# EAGLE design RPIBoard (EAGLE 7.6.0)
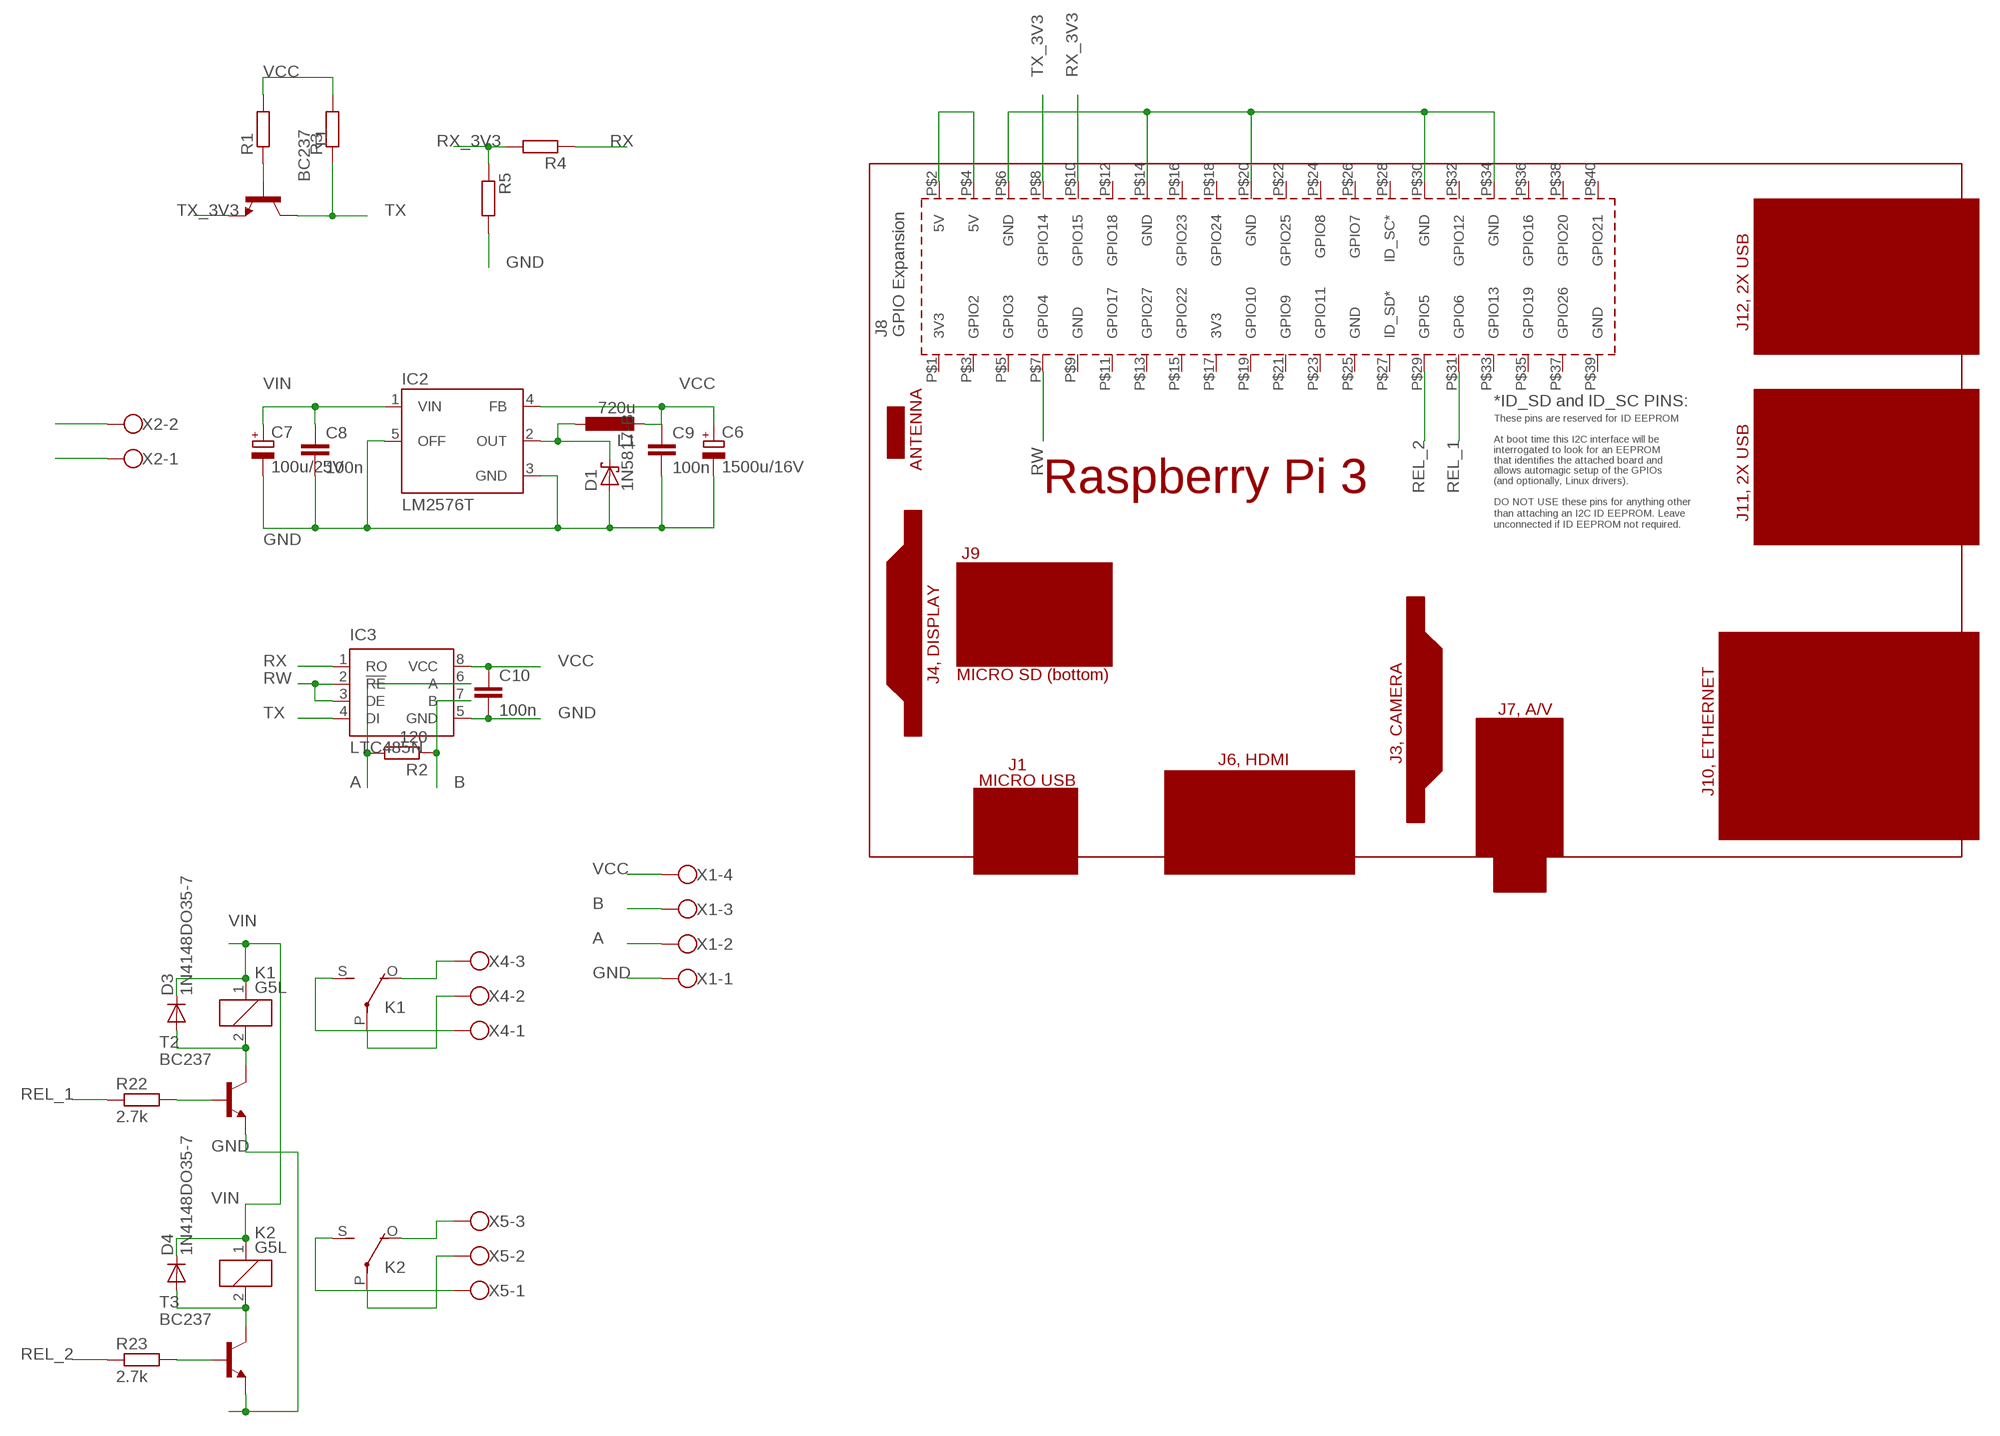
[diagram p0: schematic, sheet 1]

## Parts
C6  1500u/16V  CPOL-EUE5-10.5  [E5-10,5]
C7  100u/25V  CPOL-EUE2.5-7  [E2,5-7]
C8  100n  C-EU025-024X044  [C025-024X044]
C9  100n  C-EU025-024X044  [C025-024X044]
C10  100n  C-EU025-024X044  [C025-024X044]
D1  1N5817-B  [DO41-7.6]
D3  1N4148DO35-7  [DO35-7]
D4  1N4148DO35-7  [DO35-7]
IC2  LM2576T  [TO220-5]
IC3  LTC485N  [DIL08]
K1  G5L  [G5LE]
K2  G5L  [G5LE]
L1  720u  L-EUTJ3-U1  [TJ3-U1]
PCB1  RPI3  [RPI3]
R1  R-EU_0207/7  [0207/7]
R2  120  R-EU_0204/7  [0204/7]
R3  R-EU_0207/7  [0207/7]
R4  R-EU_0207/7  [0207/7]
R5  R-EU_0207/7  [0207/7]
R22  2.7k  R-EU_0204/7  [0204/7]
R23  2.7k  R-EU_0204/7  [0204/7]
T1  BC237  [TO92]
T2  BC237  [TO92]
T3  BC237  [TO92]
X1  W237-4  [W237-4]
X2  W237-102  [W237-102]
X4  W237-103  [W237-103]
X5  W237-103  [W237-103]

## Nets
A: IC3.6(A) R2.2 X1.2
B: IC3.7(B) R2.1 X1.3
GND: C6.- C7.- C8.2 C9.2 C10.2 D1.A IC2.3(GND) IC2.5(OFF) IC3.5(GND) PCB1.P$6(GND) PCB1.P$14(GND) PCB1.P$20(GND) PCB1.P$30(GND) PCB1.P$34(GND) R5.2 T2.1(E) T3.1(E) X1.1 X2.1
N$1: R1.1 T1.2(B)
N$2: D1.C IC2.2(OUT) L1.1
N$3: K2.O(2:O) X5.3
N$4: K2.S(2:S) X5.1
N$5: K1.S(2:S) X4.1
N$6: K1.O(2:O) X4.3
N$8: D3.A K1.2 T2.3(C)
N$13: R22.2 T2.2(B)
N$16: K1.P(2:P) X4.2
N$18: D4.A K2.2 T3.3(C)
N$19: R23.2 T3.2(B)
N$22: K2.P(2:P) X5.2
REL_1: PCB1.P$31(GPIO6) R22.1
REL_2: PCB1.P$29(GPIO5) R23.1
RW: IC3.2(!RE) IC3.3(DE) PCB1.P$7(GPIO4)
RX: IC3.1(RO) R4.1
RX_3V3: PCB1.P$10(GPIO15) R4.2 R5.1
TX: IC3.4(DI) R3.1 T1.3(C)
TX_3V3: PCB1.P$8(GPIO14) T1.1(E)
VCC: C6.+ C9.1 C10.1 IC2.4(FB) IC3.8(VCC) L1.2 PCB1.P$2(5V) PCB1.P$4(5V) R1.2 R3.2 X1.4
VIN: C7.+ C8.1 D3.C D4.C IC2.1(VIN) K1.1 K2.1 X2.2
Unconnected: PCB1.P$1(3V3) PCB1.P$3(GPIO2) PCB1.P$5(GPIO3) PCB1.P$9(GND) PCB1.P$11(GPIO17) PCB1.P$12(GPIO18) PCB1.P$13(GPIO27) PCB1.P$15(GPIO22) PCB1.P$16(GPIO23) PCB1.P$17(3V3) PCB1.P$18(GPIO24) PCB1.P$19(GPIO10) PCB1.P$21(GPIO9) PCB1.P$22(GPIO25) PCB1.P$23(GPIO11) PCB1.P$24(GPIO8) PCB1.P$25(GND) PCB1.P$26(GPIO7) PCB1.P$27(ID_SD*) PCB1.P$28(ID_SC*) PCB1.P$32(GPIO12) PCB1.P$33(GPIO13) PCB1.P$35(GPIO19) PCB1.P$36(GPIO16) PCB1.P$37(GPIO26) PCB1.P$38(GPIO20) PCB1.P$39(GND) PCB1.P$40(GPIO21)

## Library data of the parts
C6 C7 = resistor:CPOL-EU: POLARIZED CAPACITOR, European symbol
C8-C10 = rcl:C-EU: CAPACITOR, European symbol
D1 = diode:1N581*: 1.0A SCHOTTKY BARRIER RECTIFIER Source: http://www.diodes.com/datasheets/ds23001.pdf
D3 D4 = diode:1N4148: DIODE high speed (Philips)
IC2 = v-reg-3:LM2576: National Semiconductor <http://www.national.com> 3.0A "Simple Switcher"(c) 52kHz, Vout 1.23-37V (HV: 57V), Vin 40V (HV: 60V), 50µA standby current
IC3 = linear-technology:LTC485: Low Power RS485 Interface Transceiver Source: http://www.linear.com/pc/downloadDocument.do?navId=H0,C1,C1007,C1017,P2064,D1718; OC_FARNELL: unknown; OC_NEWARK: unknown
K1 K2 = relay:G5L: RELAY 1 x switch, 10 A/120 V AC, 8 A/30 V ADC, Omron; OC_FARNELL: unknown; OC_NEWARK: unknown
L1 = rcl:L-EU: INDUCTOR, European symbol
PCB1 = e14_Rpi3_RevA:RPI3: Device for Raspberry Pi 3 board created by Dave Young for www.element14.com More information and support community is available at https://www.element14.com/community/community/raspberry-pi
R1-R5 R22 R23 = rcl:R-EU_: RESISTOR, European symbol
T1-T3 = transistor:BC237: NPN TRANSISTOR
X1 = con-wago-500:W237-4: WAGO SCREW CLAMP; OC_FARNELL: unknown; OC_NEWARK: unknown
X2 = con-wago-500:W237-102: WAGO SCREW CLAMP; MPN: 237-102; OC_FARNELL: unknown; OC_NEWARK: 70K9898
X4 X5 = con-wago-500:W237-103: WAGO SCREW CLAMP; MPN: 237-103; OC_FARNELL: unknown; OC_NEWARK: 18M7116

## Board
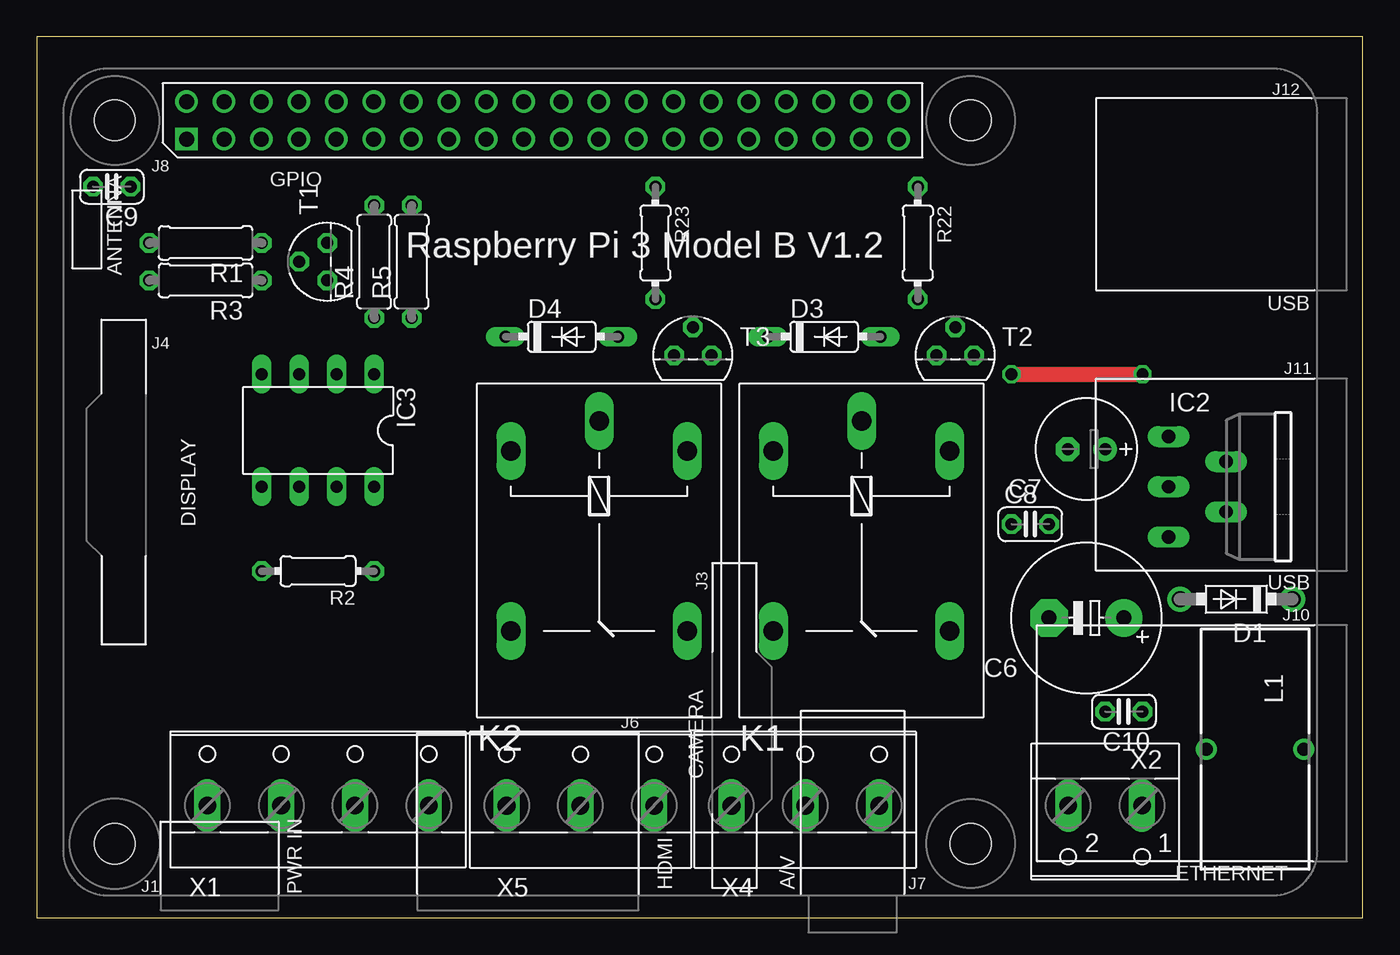
[diagram p1: board, top side]
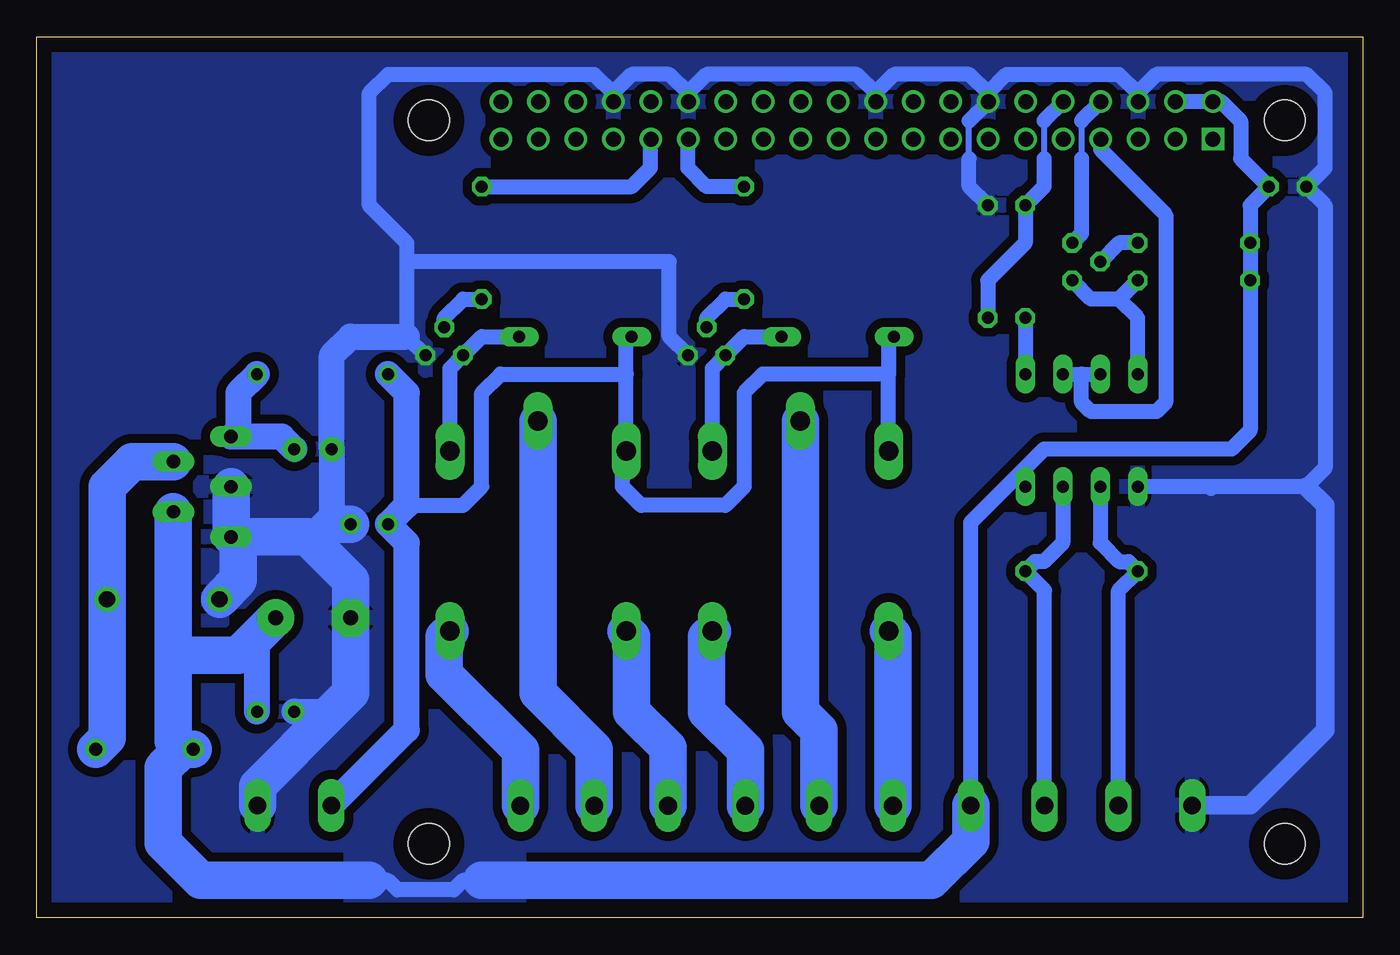
[diagram p2: board, bottom side, seen from below]

Size 89.84 x 59.68 mm. Coordinates in mm from the lower left corner, seen from the top.
Outline: 0,0 89.84,0 89.84,59.68 0,59.68 0,0
Copper layers (1*16): Top 0.035mm / dielectric 1.5mm / Bottom 0.035mm
Design rules "default": minimum track width 10mil, minimum drill 24mil, track to track 8mil, track to pad 8mil, pad to pad 8mil, via to via 8mil, smd to smd 8mil, copper to edge 40mil, drill to drill 8mil, minimum pad ring 10mil, minimum via ring 8mil, stop-mask expansion 4mil, vias tented up to drill 0mil, thermal gap 10mil

### Footprints (pad centres in the part's own frame; a part is rotated, then mirrored left to right if it is on the bottom)
E5-10,5 = drill 1.016 pad 2.54: + -2.54,0 | drill 1.016 pad 2.54 octagon: - 2.54,0
E2,5-7 = drill 0.813 pad 1.6: + -1.27,0 | drill 0.813 pad 1.6 octagon: - 1.27,0
C025-024X044 = drill 0.813 octagon: 1 -1.27,0; 2 1.27,0
DO41-7.6 = drill 1.1 pad 1.7: A 3.81,0; C -3.81,0
DO35-7 = drill 0.813 long: A 3.81,0; C -3.81,0
TO220-5 = drill 0.9 long: 1 -3.4,-8.4; 2 -1.7,-4.5; 3 0,-8.4; 4 1.7,-4.5; 5 3.4,-8.4
DIL08 = drill 0.813 long: 1 -3.81,-3.81; 2 -1.27,-3.81; 3 1.27,-3.81; 4 3.81,-3.81; 5 3.81,3.81; 6 1.27,3.81; 7 -1.27,3.81; 8 -3.81,3.81
G5LE = drill 1.321 long: 1 -7.493,-5.969; 2 -7.493,5.969; O 4.699,5.969; P -9.525,0; S 4.699,-5.969
TJ3-U1 = drill 0.9: 1 -3.3,0; 2 3.3,0
RPI3 = drill 1.016 square: P$1 8.37,51.23 | drill 1.016: P$2 8.357,53.772; P$3 10.897,51.232; P$4 10.897,53.772; P$5 13.437,51.232; P$6 13.437,53.772; P$7 15.977,51.232; P$8 15.977,53.772; P$9 18.517,51.232; P$10 18.517,53.772; P$11 21.057,51.232; P$12 21.057,53.772; P$13 23.597,51.232; P$14 23.597,53.772; P$15 26.137,51.232; P$16 26.137,53.772; P$17 28.677,51.232; P$18 28.677,53.772; P$19 31.217,51.232; P$20 31.217,53.772; P$21 33.757,51.232; P$22 33.757,53.772; P$23 36.297,51.232; P$24 36.297,53.772; P$25 38.837,51.232; P$26 38.837,53.772; P$27 41.377,51.232; P$28 41.377,53.772; P$29 43.917,51.232; P$30 43.917,53.772; P$31 46.457,51.232; P$32 46.457,53.772; P$33 48.997,51.232; P$34 48.997,53.772; P$35 51.537,51.232; P$36 51.537,53.772; P$37 54.077,51.232; P$38 54.077,53.772; P$39 56.617,51.232; P$40 56.617,53.772 | hole 2.75: 3.5,3.5; 61.5,3.5; 3.5,52.5; 61.5,52.5
0207/7 = drill 0.813 octagon: 1 -3.81,0; 2 3.81,0
0204/7 = drill 0.813 octagon: 1 -3.81,0; 2 3.81,0
TO92 = drill 0.813 octagon: 1 1.27,0; 2 0,1.905; 3 -1.27,0
W237-4 = drill 1.194 long: 1 -7.5,-1.27; 2 -2.5,-1.27; 3 2.5,-1.27; 4 7.5,-1.27
W237-102 = drill 1.194 long: 1 -2.5,-1.27; 2 2.5,-1.27
W237-103 = drill 1.194 long: 1 -5,-1.29; 2 0,-1.29; 3 5,-1.29

### Placement (x,y rotation side)
C6  71.12,20.32 180 top
C7  71.12,31.75 180 top
C8  67.31,26.67 0 top
C9  5.08,49.53 180 top
C10  73.66,13.97 180 top
D1  81.28,21.59 180 top
D3  53.34,39.37 0 top
D4  35.56,39.37 0 top
IC2  85.09,29.21 270 top
IC3  19.05,33.02 180 top
K1  55.88,24.13 270 top
K2  38.1,24.13 270 top
L1  82.55,11.43 180 top
PCB1  1.78,1.52 0 top
R1  11.43,45.72 180 top
R2  19.05,23.5 180 top
R3  11.43,43.18 180 top
R4  22.86,44.45 90 top
R5  25.4,44.45 90 top
R22  59.69,45.72 270 top
R23  41.91,45.72 270 top
T1  19.68,44.45 90 top
T2  62.23,38.1 0 top
T3  44.45,38.1 0 top
X1  19.05,8.89 0 top
X2  72.39,6.35 180 top
X4  52.07,8.89 0 top
X5  36.83,8.89 0 top

### Tracks (layer width: path | path; a pad name or v marks a point on that pad's centre or on a via)
A
  Bottom 1.016: IC3.6 17.78,25.4 16.51,24.13 15.88,24.13 R2.2 16.55,22.18 X1.2
B
  Bottom 1.016: IC3.7 20.32,25.4 21.59,24.13 22.23,24.13 R2.1 21.55,22.18 X1.3
GND
  Bottom 0.406: 26.67,51.44 26.67,53.98
  Bottom 1.016: PCB1.P$14 25.38,55.85 26.67,57.15 31.75,57.15 33.02,55.88 33.02,55.32 PCB1.P$20 32.99,55.85 34.29,57.15 44.45,57.15 45.72,55.88 45.72,55.32 PCB1.P$30 45.7,55.85 46.99,57.15 49.53,57.15 50.8,55.88 | 50.8,55.88 50.8,55.32 PCB1.P$34 | PCB1.P$14 25.38,55.91 24.13,57.15 16.51,57.15 15.24,55.88 | 15.24,55.88 15.24,55.32 PCB1.P$6 | 15.24,55.88 13.97,57.15 3.81,57.15 2.54,55.88 2.54,50.8 C9.2 2.54,48.26 2.54,30.48 3.81,29.21 10.16,29.21 | R5.2 26.67,49.53 26.67,51.44 | 26.67,53.98 26.67,54 PCB1.P$14 | 10.16,29.21 IC3.5 | 10.28,29.09 10.16,29.21 | T3.1 46.99,39.37 46.99,44.45 64.77,44.45 | 64.77,44.45 64.77,45.72 67.31,48.26 67.31,55.88 66.04,57.15 52.07,57.15 50.8,55.88 | 64.77,44.45 64.77,39.37 T2.1
  Bottom 1.27: X1.1 7.62,7.62 2.54,12.7 2.54,27.94 3.81,29.21
  Bottom 1.778: C10.2 69.85,13.97 | 69.85,26.67 C7.- 69.85,38.1 68.58,39.37 64.77,39.37
  Bottom 2.54: X2.1 74.89,8.93 69.85,13.97 68.58,15.24 C6.- 68.58,22.86 71.12,25.4 | IC2.5 IC2.3 | C8.2 69.85,26.67 71.12,25.4 | D1.A 76.2,22.86 76.2,25.32 IC2.5 | 71.12,25.4 71.53,25.81 IC2.5
  pour Bottom (isolate 0.61): 0,59.69 90.17,59.69 90.17,0 0,0
N$1
  Bottom 1.016: R1.1 16.51,45.72 T1.2
N$2
  Bottom 2.54: IC2.2 83.39,30.91 85.09,29.21 D1.C 85.09,12.19 L1.1
N$3
  Bottom 2.54: X5.3 41.83,11.35 44.45,13.97 44.45,19.05 K2.O
N$4
  Bottom 2.54: X5.1 31.83,19.13 K2.S
N$5
  Bottom 2.54: X4.1 47.07,11.51 49.53,13.97 49.53,19.05 K1.S
N$6
  Bottom 2.54: X4.3 57.07,11.35 62.23,16.51 62.23,19.05 K1.O
N$8
  Bottom 1.016: K1.2 61.85,37.21 T2.3 59.69,39.37 D3.A
N$13
  Bottom 1.016: T2.2 62.23,40.64 60.96,41.91 R22.2
N$16
  Bottom 2.54: X4.2 52.07,11.43 55.88,15.24 K1.P
N$18
  Bottom 1.016: K2.2 44.07,37.21 T3.3 41.91,39.37 D4.A
N$19
  Bottom 1.016: T3.2 44.45,40.64 43.18,41.91 R23.2
N$22
  Bottom 2.54: X5.2 36.83,12.7 38.1,13.97 K2.P
REL_1
  Bottom 1.016: R22.1 49.53,49.53 48.26,50.8 48.26,52.73 PCB1.P$31
REL_2
  Bottom 1.016: R23.1 44.45,49.53 45.72,50.8 45.72,52.73 PCB1.P$29
RW
  Bottom 1.016: PCB1.P$7 17.75,52.05 13.34,47.62 13.34,34.92 13.97,34.29 18.41,34.29 19.05,34.92 19.05,36.83 | 19.05,36.83 IC3.3 | IC3.2 19.05,36.83
RX
  Bottom 1.016: R4.1 IC3.1
RX_3V3
  Bottom 0.406: 21.59,53.98 21.59,51.44
  Bottom 1.016: PCB1.P$10 21.59,54 21.59,53.98 | 21.59,51.44 21.59,49.53 R4.2 22.86,45.72 25.4,43.18 R5.1
TX
  Bottom 1.016: R3.1 16.51,41.91 | T1.3 18.41,41.91 16.51,41.91 | IC3.4 15.24,40.64 16.51,41.91
TX_3V3
  Bottom 0.406: 19.05,53.98 19.05,51.44
  Bottom 1.016: PCB1.P$8 19.05,54 19.05,53.98 | 19.05,51.44 19.05,46.35 T1.1
VCC
  Bottom 1.016: PCB1.P$4 PCB1.P$2 9.58,55.3 8.26,53.98 8.26,51.44 C9.1 7.62,48.26 R1.2 R3.2 7.62,33.02 8.89,31.75 21.59,31.75 22.86,30.48 | 22.86,30.48 IC3.8 | X1.4 26.55,26.79 22.86,30.48 | 59.69,2.54 60.96,2.54 61.59,1.91 65.41,1.91 66.04,2.54 67.31,2.54
  Bottom 1.778: C10.1 74.93,19.05 74.3,19.68
  Bottom 2.54: IC2.4 80.59,17.78 | 80.59,17.78 80.59,12.01 80.01,11.43 | 80.01,11.43 L1.2 | X1.4 26.55,5.2 29.21,2.54 59.69,2.54 | 80.01,11.43 81.28,10.16 81.28,5.08 78.74,2.54 67.31,2.54 | C6.+ 74.3,19.68 76.2,17.78 80.59,17.78
  pour Bottom (isolate 0.61): 68.58,0 57.15,0 57.15,10.16 68.58,10.16
VIN  (via drill 0.8)
  Top 1.016: v66.04,36.83 v74.93,36.83
  Bottom 1.016: K2.1 32.13,36.83 | D4.C 32.13,38.99 32.13,36.83 | 32.13,36.83 40.64,36.83 41.91,35.56 41.91,29.21 43.18,27.94 48.9,27.94 50.16,29.21 50.16,31.37 K1.1 49.91,36.83 | 49.91,36.83 49.91,38.99 D3.C | 64.77,27.94 60.96,27.94 59.69,29.21 59.69,35.56 58.42,36.83 49.91,36.83
  Bottom 1.778: X2.2 64.77,12.74 64.77,25.4 C8.1 64.77,27.94 64.77,35.56 v66.04,36.83 | C7.+ 73.25,32.61 76.2,32.61 | 76.2,32.61 IC2.1 | v74.93,36.83 76.2,35.56 76.2,32.61